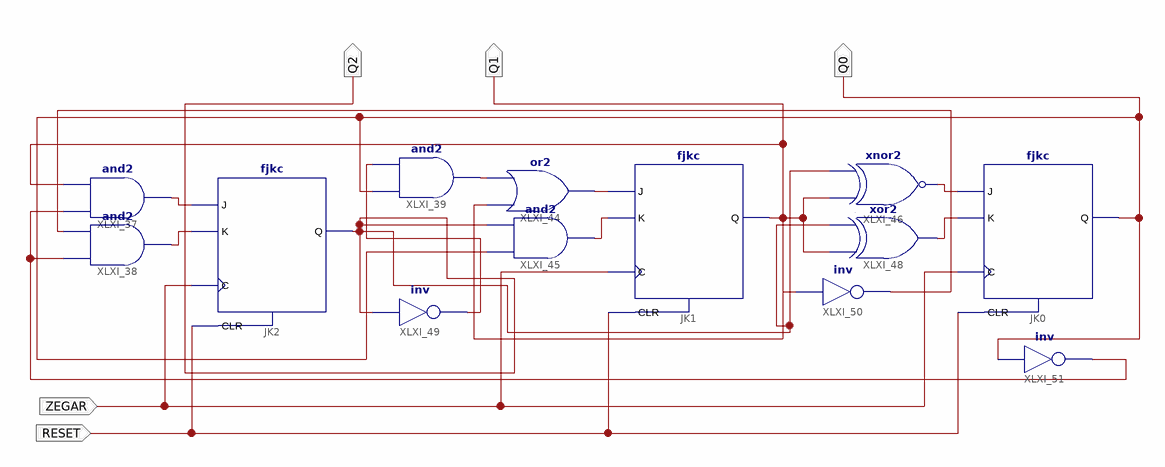
[diagram p0: schematic sheet 1]
// Xilinx ISE schematic zad1schemat.sch (artix7) as structural Verilog: 13 symbols, 5 ports
module zad1schemat (
  input  ZEGAR,
  input  RESET,
  output Q2,
  output Q1,
  output Q0
);

  wire XLXN_52, XLXN_53, XLXN_54, XLXN_55, XLXN_56, XLXN_57, XLXN_58, XLXN_66, XLXN_67, XLXN_72;

  fjkc JK2 (.C(ZEGAR), .CLR(RESET), .J(XLXN_52), .K(XLXN_53), .Q(Q2));
  and XLXI_37 (XLXN_52, XLXN_66, Q1);
  and XLXI_38 (XLXN_53, XLXN_66, XLXN_67);
  and XLXI_39 (XLXN_58, Q0, XLXN_72);
  fjkc JK0 (.C(ZEGAR), .CLR(RESET), .J(XLXN_56), .K(XLXN_57), .Q(Q0));
  fjkc JK1 (.C(ZEGAR), .CLR(RESET), .J(XLXN_54), .K(XLXN_55), .Q(Q1));
  or XLXI_44 (XLXN_54, Q1, XLXN_58);
  and XLXI_45 (XLXN_55, Q0, Q2);
  xnor XLXI_46 (XLXN_56, Q1, Q2);
  xor XLXI_48 (XLXN_57, Q1, Q2);
  not XLXI_49 (XLXN_72, Q2);
  not XLXI_50 (XLXN_67, Q1);
  not XLXI_51 (XLXN_66, Q0);
endmodule
